# Altium project Sony UX.PrjPcb
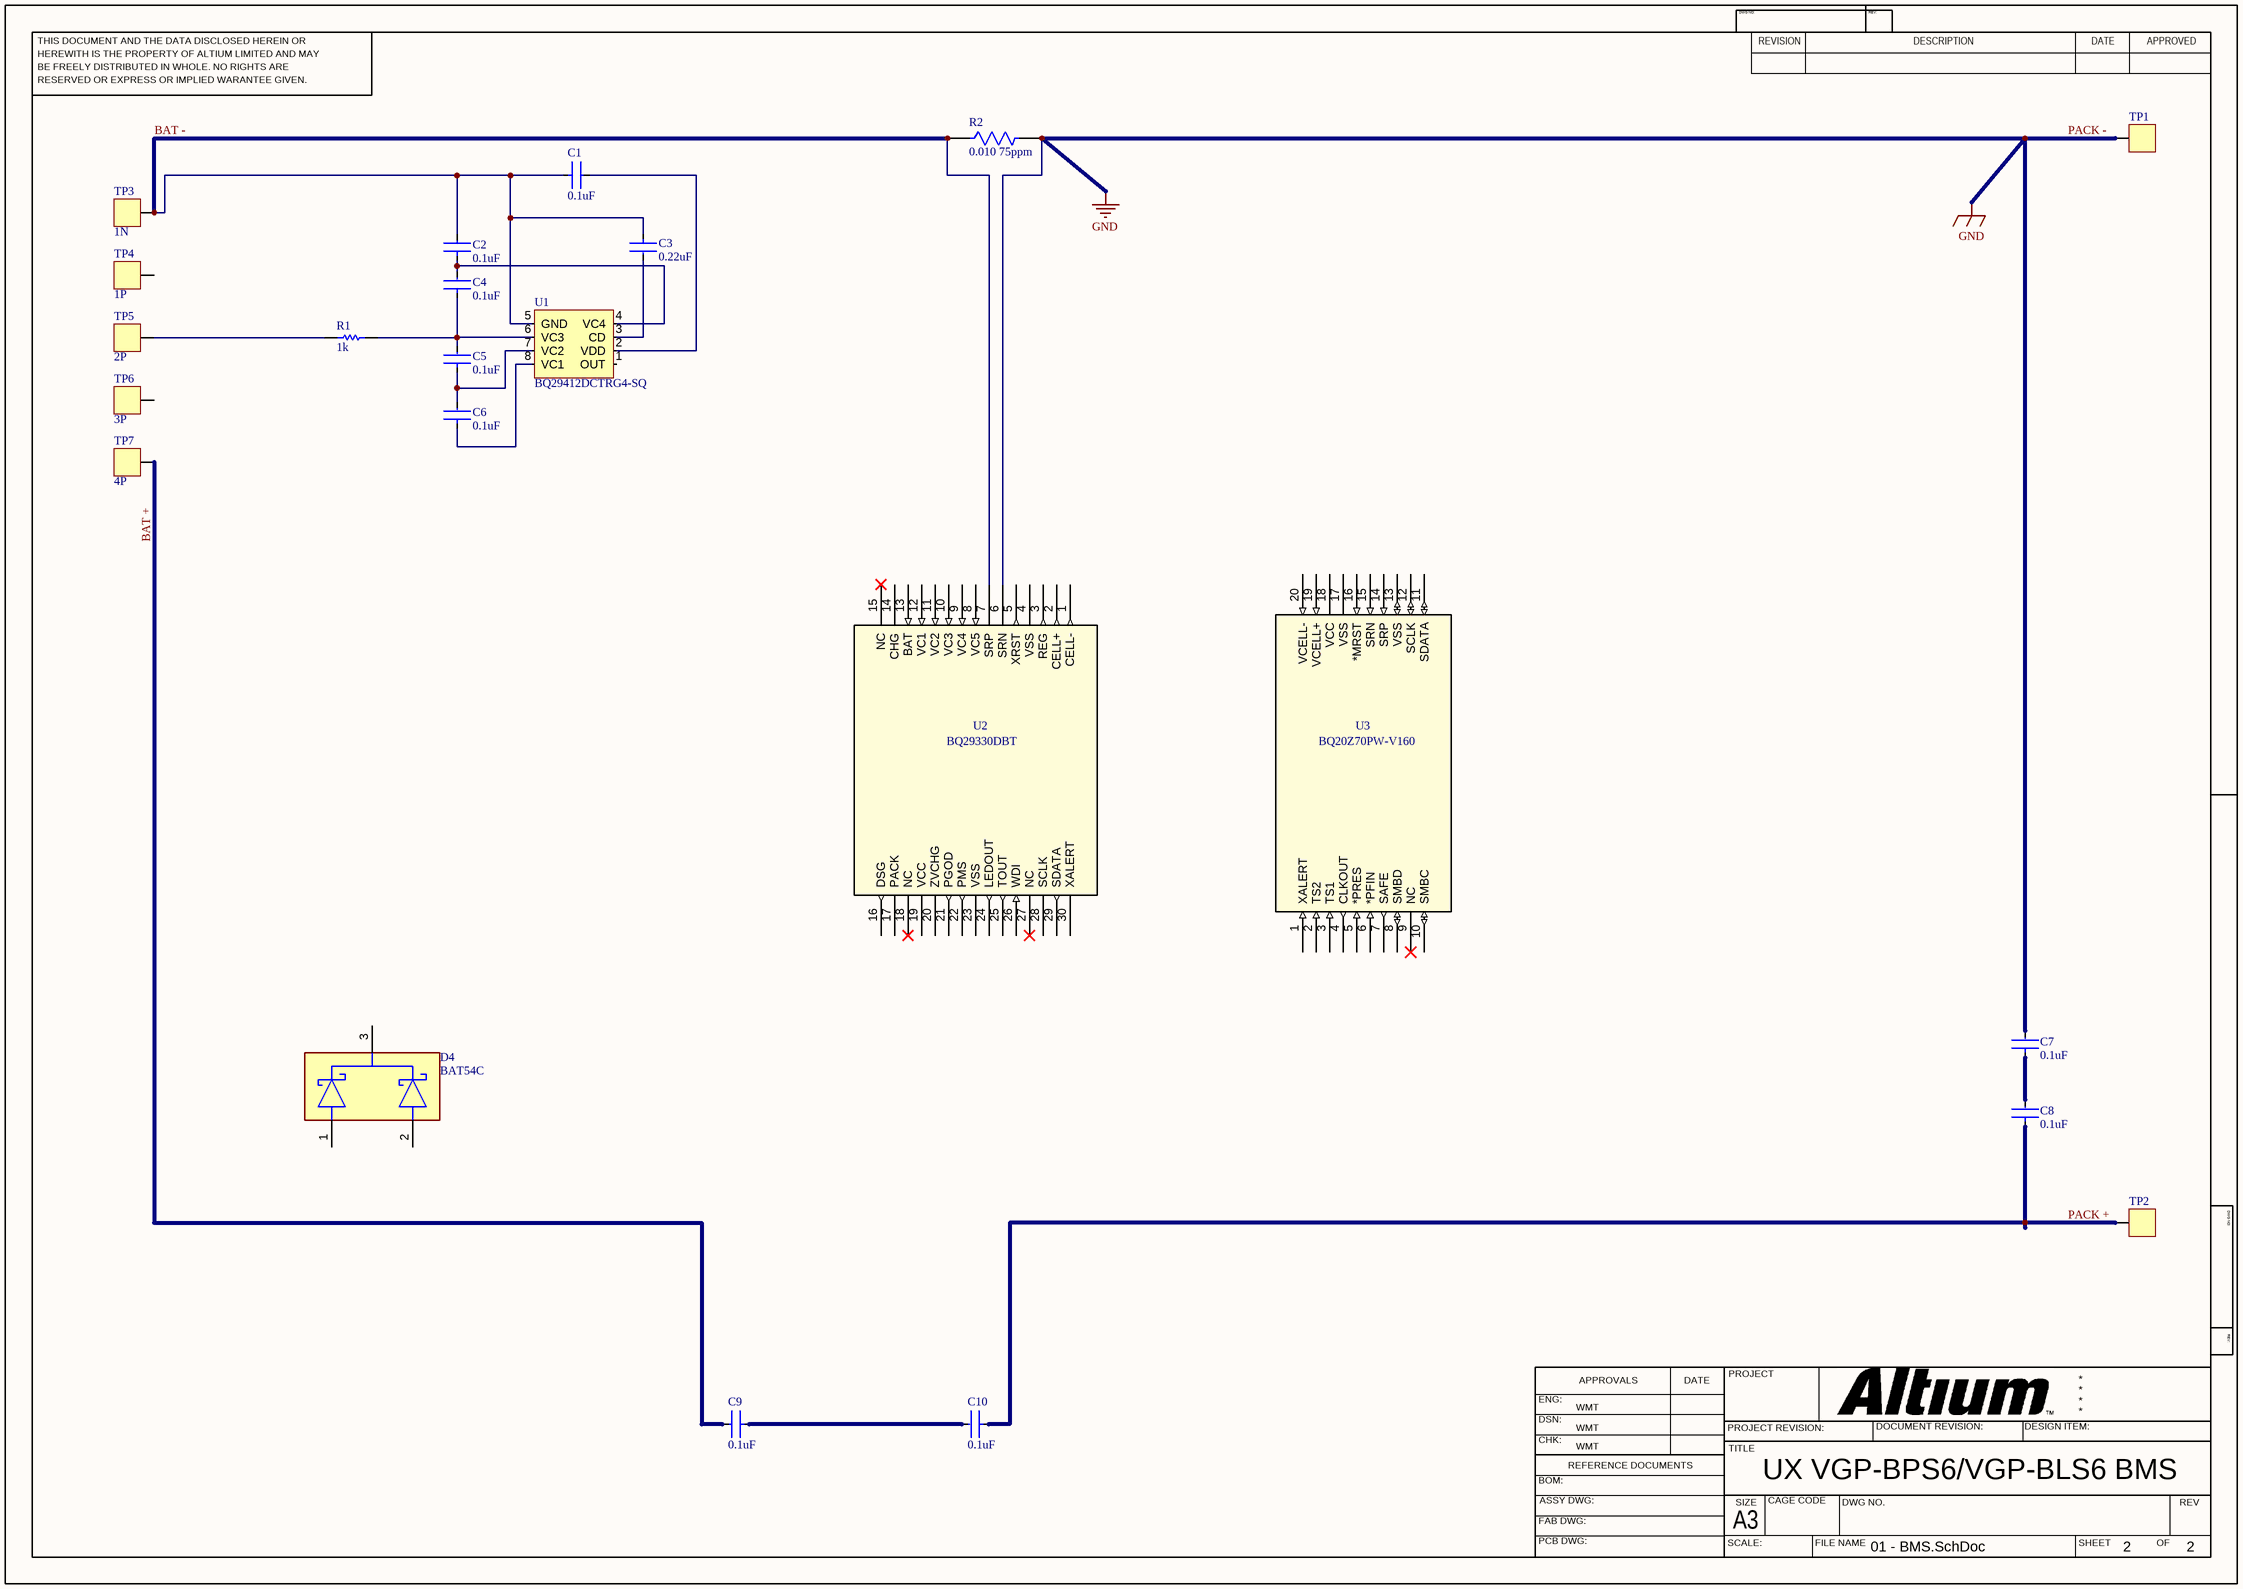
[diagram p0: 01 - BMS.SchDoc]
2 sheets, 23 parts. Net scope: global (net labels, ports and power ports of the same name join across sheets).
Board file: Sony UX BMS.PcbDoc
Sheets:
  00 - Block.SchDoc
  01 - BMS.SchDoc

## Sheet 00 - Block.SchDoc: UX VGP-BPS6/VGP-BLS6 BMS
size 420 x 297 mm; Date: 03/14/25; ApprovedBy: WMT; CheckedBy: WMT; Author: WMT; CompanyName: DISCORD SERVER IDEAS; DrawnBy: WMT; Engineer: WMT; Organization: Discord; DocumentNumber: A; Revision: A; SheetNumber: 1; SheetTotal: 2

### Notes on the sheet
- THIS DOCUMENT AND THE DATA DISCLOSED HEREIN OR
- HEREWITH IS THE PROPERTY OF ALTIUM LIMITED AND MAY
- DWG NO:
- REVISION
- REV:
- DESCRIPTION
- DATE
- APPROVED
- BE FREELY DISTRIBUTED IN WHOLE. NO RIGHTS ARE
- RESERVED OR EXPRESS OR IMPLIED WARANTEE GIVEN.
- ENG:
- APPROVALS
- PROJECT
- DSN:
- CHK:
- REFERENCE DOCUMENTS
- PROJECT REVISION:
- TITLE
- DOCUMENT REVISION:
- DESIGN ITEM:
- BOM:
- FAB DWG:
- PCB DWG:
- ASSY DWG:
- SCALE:
- A3
- SIZE
- CAGE CODE
- FILE NAME
- DWG NO.
- SHEET
- OF
- REV

## Sheet 01 - BMS.SchDoc: UX VGP-BPS6/VGP-BLS6 BMS
size 420 x 297 mm; Date: 03/14/25; ApprovedBy: WMT; CheckedBy: WMT; Author: WMT; CompanyName: DISCORD SERVER IDEAS; DrawnBy: WMT; Engineer: WMT; Organization: Discord; DocumentNumber: A; Revision: A; SheetNumber: 2; SheetTotal: 2

### Parts
C1  0.1uF  [FP-GRM033-0_03-IPC_C]
C2  0.1uF  [FP-GRM033-0_03-IPC_C]
C3  0.22uF  [FP-CL03-IPC_C]
C4  0.1uF  [FP-GRM033-0_03-IPC_C]
C5  0.1uF  [FP-GRM033-0_03-IPC_C]
C6  0.1uF  [FP-GRM033-0_03-IPC_C]
C7  0.1uF  [FP-GRM033-0_03-IPC_C]
C8  0.1uF  [FP-GRM033-0_03-IPC_C]
C9  0.1uF  [FP-GRM033-0_03-IPC_C]
C10  0.1uF  [FP-GRM033-0_03-IPC_C]
D4  BAT54C  [FP-MA03D-MFG]
R1  1k  [RESC0603X26X15LL03T05]
R2  0.010 75ppm  [FP-ERJ8CW-MFG]
TP1  Pad  [PAD_SQ_2MM]  (value not drawn)  (no BOM)
TP2  Pad  [PAD_SQ_2MM]  (value not drawn)  (no BOM)
TP3  1N  [PAD_SQ_2MM]  (no BOM)
TP4  1P  [PAD_SQ_2MM]  (no BOM)
TP5  2P  [PAD_SQ_2MM]  (no BOM)
TP6  3P  [PAD_SQ_2MM]  (no BOM)
TP7  4P  [PAD_SQ_2MM]  (no BOM)
U1  BQ29412DCTRG4-SQ  [DCT8]
U2  BQ29330DBT  [DBT30]
U3  BQ20Z70PW-V160  [PW20]

### Nets
PACK -: C7.2 R2.2 TP1.1 U2.6(SRN)  [also labelled GND]
BAT +: C9.2 TP7.1
BAT -: C1.1 C2.2 C3.1 R2.1 TP3.1 U1.5(GND) U2.7(SRP)
PACK +: C8.1 C10.1 TP2.1
NetC1_2: C1.2 U1.2(VDD)
NetC2_1: C2.1 C4.2 U1.4(VC4)
NetC3_2: C3.2 U1.3(CD)
NetC4_1: C4.1 C5.2 R1.2 U1.6(VC3)
NetC5_1: C5.1 C6.2 U1.7(VC2)
NetC6_1: C6.1 U1.8(VC1)
NetC7_1: C7.1 C8.2
NetC9_1: C9.1 C10.2
NetR1_1: R1.1 TP5.1

Not connected (* = marked no-connect by the designer): D4 1(1_ANODE) 2(2_ANODE) 3(COMMON_CATHODE); TP4 1; TP6 1; U1 1(OUT); U2 1(CELL-) 2(CELL+) 3(REG) 4(VSS) 5(XRST) 8(VC5) 9(VC4) 10(VC3) 11(VC2) 12(VC1) 13(BAT) 14(CHG) 15(NC)* 16(DSG) 17(PACK) 18(NC)* 19(VCC) 20(ZVCHG) 21(PGOD) 22(PMS) 23(VSS) 24(LEDOUT) 25(TOUT) 26(WDI) 27(NC)* 28(SCLK) 29(SDATA) 30(XALERT); U3 1(XALERT) 2(TS2) 3(TS1) 4(CLKOUT) 5(*PRES) 6(*PFIN) 7(SAFE) 8(SMBD) 9(NC)* 10(SMBC) 11(SDATA) 12(SCLK) 13(VSS) 14(SRP) 15(SRN) 16(*MRST) 17(VSS) 18(VCC) 19(VCELL+) 20(VCELL-)

### Notes on the sheet
- THIS DOCUMENT AND THE DATA DISCLOSED HEREIN OR
- HEREWITH IS THE PROPERTY OF ALTIUM LIMITED AND MAY
- DWG NO:
- REVISION
- REV:
- DESCRIPTION
- DATE
- APPROVED
- BE FREELY DISTRIBUTED IN WHOLE. NO RIGHTS ARE
- RESERVED OR EXPRESS OR IMPLIED WARANTEE GIVEN.
- ENG:
- APPROVALS
- PROJECT
- DSN:
- CHK:
- REFERENCE DOCUMENTS
- PROJECT REVISION:
- TITLE
- DOCUMENT REVISION:
- DESIGN ITEM:
- BOM:
- FAB DWG:
- PCB DWG:
- ASSY DWG:
- SCALE:
- A3
- SIZE
- CAGE CODE
- FILE NAME
- DWG NO.
- SHEET
- OF
- REV

### Library data of the parts
C1 C2 C4-C10 = CMP-2010-01264-2: Chip Multilayer Ceramic Capacitors for General Purpose, 0201, 0.10uF, X5R, 15%, 10%, 10V; Capacitance: 100nF; Mount: Surface Mount; Dielectric: X5R; Width: 0.012inch; Tolerance: 10%; Radiation Hardening: No; Voltage Rating: 10V; REACH SVHC: No SVHC; Height: 0.3mm; Max Operating Temperature: 85°C; Voltage Rating (DC): 10V; Thickness: 0.013inch; Termination: SMD/SMT; Lead Free: Lead Free; Package Quantity: 1; Case/Package: 0201; Min Operating Temperature: -55°C; Weight: 6E-06oz; Length: 0.6mm; Case Code (Imperial): 0201; Depth: 0.3mm; Voltage: 10V; Packaging: Tape and Reel; Case Code (Metric): 0603
C3 = CMP-13271-002367-1: Cap Ceramic 220nF 10V X5R ±10% Pad SMD 0201 +85°C T/R; Packaging: Tape and Reel; Lead Free: Lead Free; Max Operating Temperature: 85°C; Min Operating Temperature: -55°C; Voltage Rating (DC): 10V; Dielectric: X5R; Case Code (Metric): 0603; Depth: 0.3mm; Mount: Surface Mount; Radiation Hardening: No; Case/Package: 0201; Thickness: 0.013inch; Case Code (Imperial): 0201; Package Quantity: 1; Tolerance: 10%; Width: 0.012inch; Length: 0.6mm; Capacitance: 220nF; Voltage Rating: 10V
D4 = CMP-07162-000010-1: DIODE ARRAY SCHOTTKY 30V SOT23-3; Obsolete Part: true; Manufacturer: ON Semiconductor; Max Junction Temp: +150°C; Forward Current: 200mA; Peak Reverse Current: 2uA; Standoff Height: 0mm; Capacitance: 10pF; Max Surge Forward Current: 600mA; Value: 10pF; Device Class L3: Schottky Diodes; ComponentLink2Description: Datasheet; Category: Diode; Max Repetitive Reverse Voltage: 30V; ComponentLink2URL: https://media.digikey.com/pdf/Data%20Sheets/ON%20Semiconductor%20PDFs/BAT54(A,C,S).pdf; Package: MA03D; Octopart: https://octopart.com/bat54c-on+semiconductor-8095621; Height: 1.2mm; Reverse Voltage: 30V; Manufacturer Part Number: BAT54C; Automotive: No; Device Class L1: Discrete Semiconductors; Temperature Range Low: -55°C; Device Class L2: Diodes; Digikey Description: DIODE ARRAY SCHOTTKY 30V SOT23-3; Temperature: -55°C to +150°C; Temperature Range High: +150°C
R1 = CMP-2004-03624-1: Manufacturer: TE Connectivity / AMP; Part Number: CRG0201F1K0
R2 = CMP-2003-00786-2: RES 0.01 OHM 1% 1W 1206; Temperature Coefficient: 75ppm/°C; Resistance: 10mR; Military Standard: Not; Depth: 1.6mm; Mount: Surface Mount; Resistor Type: Thick Film; Termination: Flat; Features: Automotive AEC-Q200; Number of Terminations: 2; Max Power Dissipation: 1W; Tolerance: 1%; Case Code (Imperial): 1206; Max Operating Temperature: 125°C; Case Code (Metric): 3216; Lead Free: Lead Free; Case/Package: 1206; Power Rating: 1W; Width: 0.063inch; Packaging: Cut Tape; Length: 3.2mm; Height: 0.03inch; REACH SVHC: No SVHC; Min Operating Temperature: -55°C
TP1-TP7 = PAD_SQ_2MM: Test Point Square 2mm
U2 = BQ29330DBT: No Description Available; Mfr_Name: Texas Instruments; RefDes: RefDes; Type: Type
U3 = BQ20Z70PW-V160: No Description Available; Mfr_Name: Texas Instruments; RefDes: RefDes; Type: Type